# Altium schematic sheet AMDS.SchDoc
size 381 x 241 mm; SheetNumber: 6; SheetTotal: 6
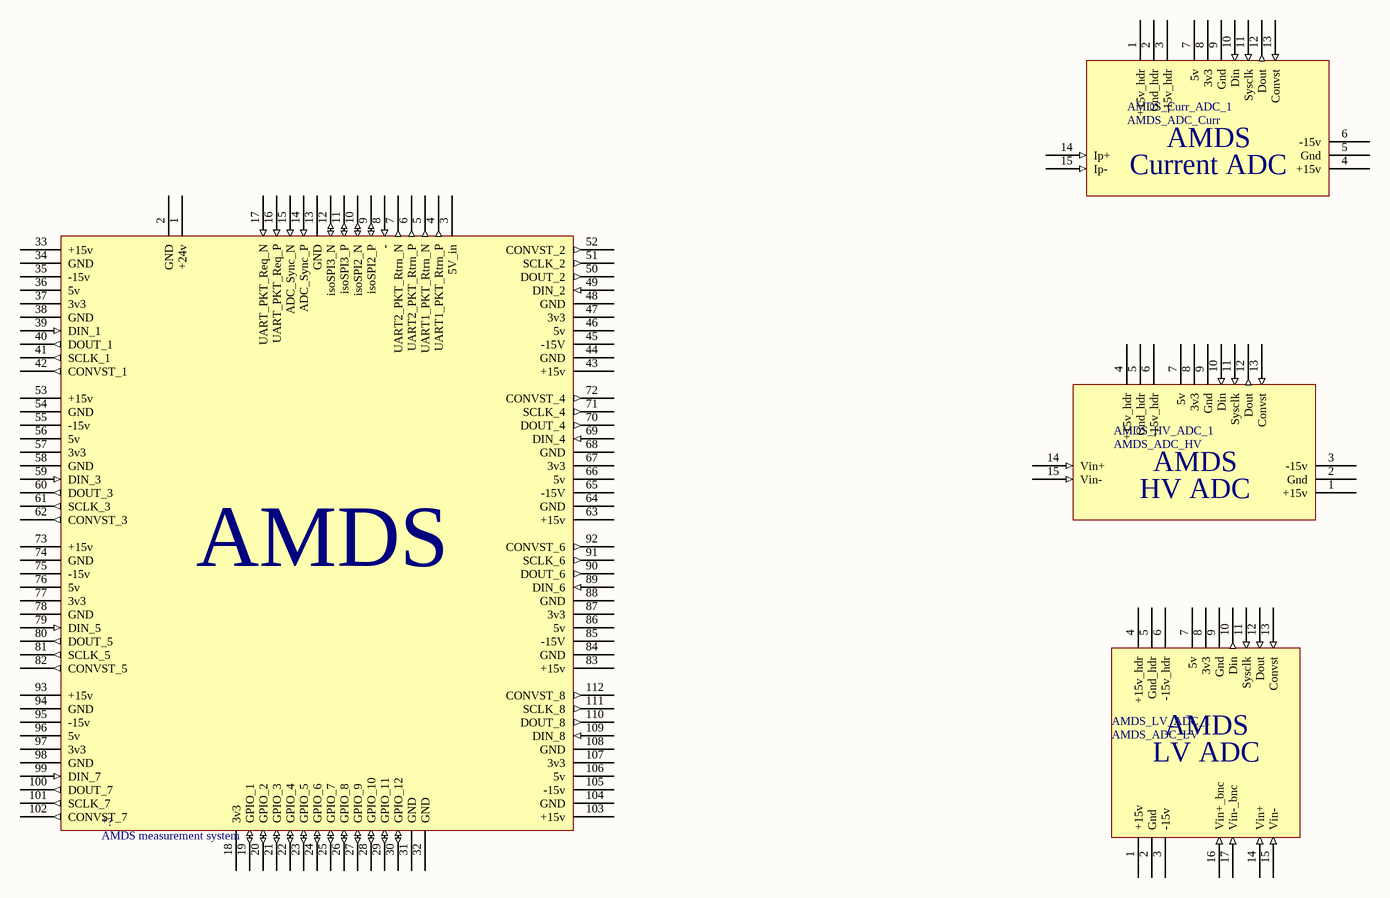
[diagram p0: AMDS.SchDoc]

## Parts
*?  AMDS measurement system
AMDS_Curr_ADC_1  AMDS_ADC_Curr
AMDS_HV_ADC_1  AMDS_ADC_HV
AMDS_LV_ADC_1  AMDS_ADC_LV

## Nets

Not connected (* = marked no-connect by the designer): *? 1(+24v) 2(GND) 3(5V_in) 4(UART1_PKT_Rtrn_P) 5(UART1_PKT_Rtrn_N) 6(UART2_PKT_Rtrn_P) 7(UART2_PKT_Rtrn_N) 8(-) 9(isoSPI2_P) 10(isoSPI2_N) 11(isoSPI3_P) 12(isoSPI3_N) 13(GND) 14(ADC_Sync_P) 15(ADC_Sync_N) 16(UART_PKT_Req_P) 17(UART_PKT_Req_N) 18(3v3) 19(GPIO_1) 20(GPIO_2) 21(GPIO_3) 22(GPIO_4) 23(GPIO_5) 24(GPIO_6) 25(GPIO_7) 26(GPIO_8) 27(GPIO_9) 28(GPIO_10) 29(GPIO_11) 30(GPIO_12) 31(GND) 32(GND) 33(+15v) 34(GND) 35(-15v) 36(5v) 37(3v3) 38(GND) 39(DIN_1) 40(DOUT_1) 41(SCLK_1) 42(CONVST_1) 43(+15v) 44(GND) 45(-15V) 46(5v) 47(3v3) 48(GND) 49(DIN_2) 50(DOUT_2) 51(SCLK_2) 52(CONVST_2) 53(+15v) 54(GND) 55(-15v) 56(5v) 57(3v3) 58(GND) 59(DIN_3) 60(DOUT_3) 61(SCLK_3) 62(CONVST_3) 63(+15v) 64(GND) 65(-15V) 66(5v) 67(3v3) 68(GND) 69(DIN_4) 70(DOUT_4) 71(SCLK_4) 72(CONVST_4) 73(+15v) 74(GND) 75(-15v) 76(5v) 77(3v3) 78(GND) 79(DIN_5) 80(DOUT_5) 81(SCLK_5) 82(CONVST_5) 83(+15v) 84(GND) 85(-15V) 86(5v) 87(3v3) 88(GND) 89(DIN_6) 90(DOUT_6) 91(SCLK_6) 92(CONVST_6) 93(+15v) 94(GND) 95(-15v) 96(5v) 97(3v3) 98(GND) 99(DIN_7) 100(DOUT_7) 101(SCLK_7) 102(CONVST_7) 103(+15v) 104(GND) 105(-15v) 106(5v) 107(3v3) 108(GND) 109(DIN_8) 110(DOUT_8) 111(SCLK_8) 112(CONVST_8); AMDS_Curr_ADC_1 1(+15v_hdr) 2(Gnd_hdr) 3(-15v_hdr) 4(+15v) 5(Gnd) 6(-15v) 7(5v) 8(3v3) 9(Gnd) 10(Din) 11(Sysclk) 12(Dout) 13(Convst) 14(Ip+) 15(Ip-); AMDS_HV_ADC_1 1(+15v) 2(Gnd) 3(-15v) 4(+15v_hdr) 5(Gnd_hdr) 6(-15v_hdr) 7(5v) 8(3v3) 9(Gnd) 10(Din) 11(Sysclk) 12(Dout) 13(Convst) 14(Vin+) 15(Vin-); AMDS_LV_ADC_1 1(+15v) 2(Gnd) 3(-15v) 4(+15v_hdr) 5(Gnd_hdr) 6(-15v_hdr) 7(5v) 8(3v3) 9(Gnd) 10(Din) 11(Sysclk) 12(Dout) 13(Convst) 14(Vin+) 15(Vin-) 16(Vin+_bnc) 17(Vin-_bnc)

## Notes on the sheet
- (in symbol CMP-001-0003-2) AMDS
- (in symbol CMP-001-0005-3) AMDS; HV ADC
- (in symbol CMP-001-0006-5) AMDS; LV ADC
- (in symbol CMP-001-0007-3) AMDS; Current ADC

## Library data of the parts
*? = CMP-001-0003-2: AMDS measurement system to be combined with AMDC for motor control
AMDS_Curr_ADC_1 = CMP-001-0007-3: AMDS current measurement card
AMDS_HV_ADC_1 = CMP-001-0005-3: High voltage measurement card
AMDS_LV_ADC_1 = CMP-001-0006-5: Low Voltage measurement card